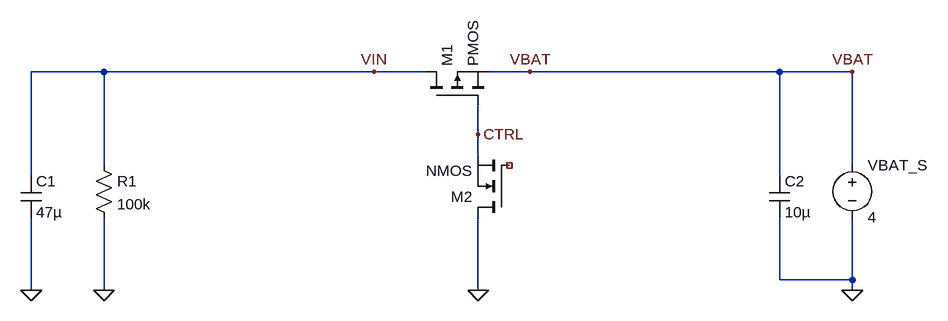
[diagram p0: schematic POWER_SWITCH.asc]
POWER_SWITCH.asc, the LTspice schematic file:
Version 4
SHEET 1 932 680
WIRE -336 112 -448 112
WIRE 80 112 -336 112
WIRE 160 112 80 112
WIRE 320 112 256 112
WIRE 704 112 320 112
WIRE 816 112 704 112
WIRE 240 208 240 160
WIRE 240 240 240 208
WIRE -336 256 -336 112
WIRE 816 256 816 112
WIRE -448 272 -448 112
WIRE 704 272 704 112
WIRE 704 432 704 336
WIRE 816 432 816 336
WIRE 816 432 704 432
WIRE -448 448 -448 336
WIRE -336 448 -336 336
WIRE 240 448 240 336
WIRE 816 448 816 432
FLAG 240 448 0
FLAG 816 448 0
FLAG -336 448 0
FLAG -448 448 0
FLAG 816 112 VBAT
FLAG 80 112 VIN
FLAG 240 208 CTRL
FLAG 320 112 VBAT
SYMBOL pmos 160 160 R270
SYMATTR InstName M1
SYMBOL nmos 288 336 R180
SYMATTR InstName M2
SYMBOL voltage 816 240 R0
WINDOW 123 0 0 Left 0
WINDOW 39 0 0 Left 0
SYMATTR InstName VBAT_S
SYMATTR Value 4
SYMBOL res -352 240 R0
SYMATTR InstName R1
SYMATTR Value 100k
SYMBOL cap -464 272 R0
SYMATTR InstName C1
SYMATTR Value 47µ
SYMBOL cap 688 272 R0
SYMATTR InstName C2
SYMATTR Value 10µ

The netlist it stands for:
* POWER_SWITCH.asc
M1 VIN CTRL VBAT VBAT PMOS
M2 0 NC_01 CTRL CTRL NMOS
VBAT_S VBAT 0 4
R1 VIN 0 100k
C1 VIN 0 47µ
C2 VBAT 0 10µ
.model NMOS NMOS
.model PMOS PMOS
.lib standard.mos
.backanno
.end